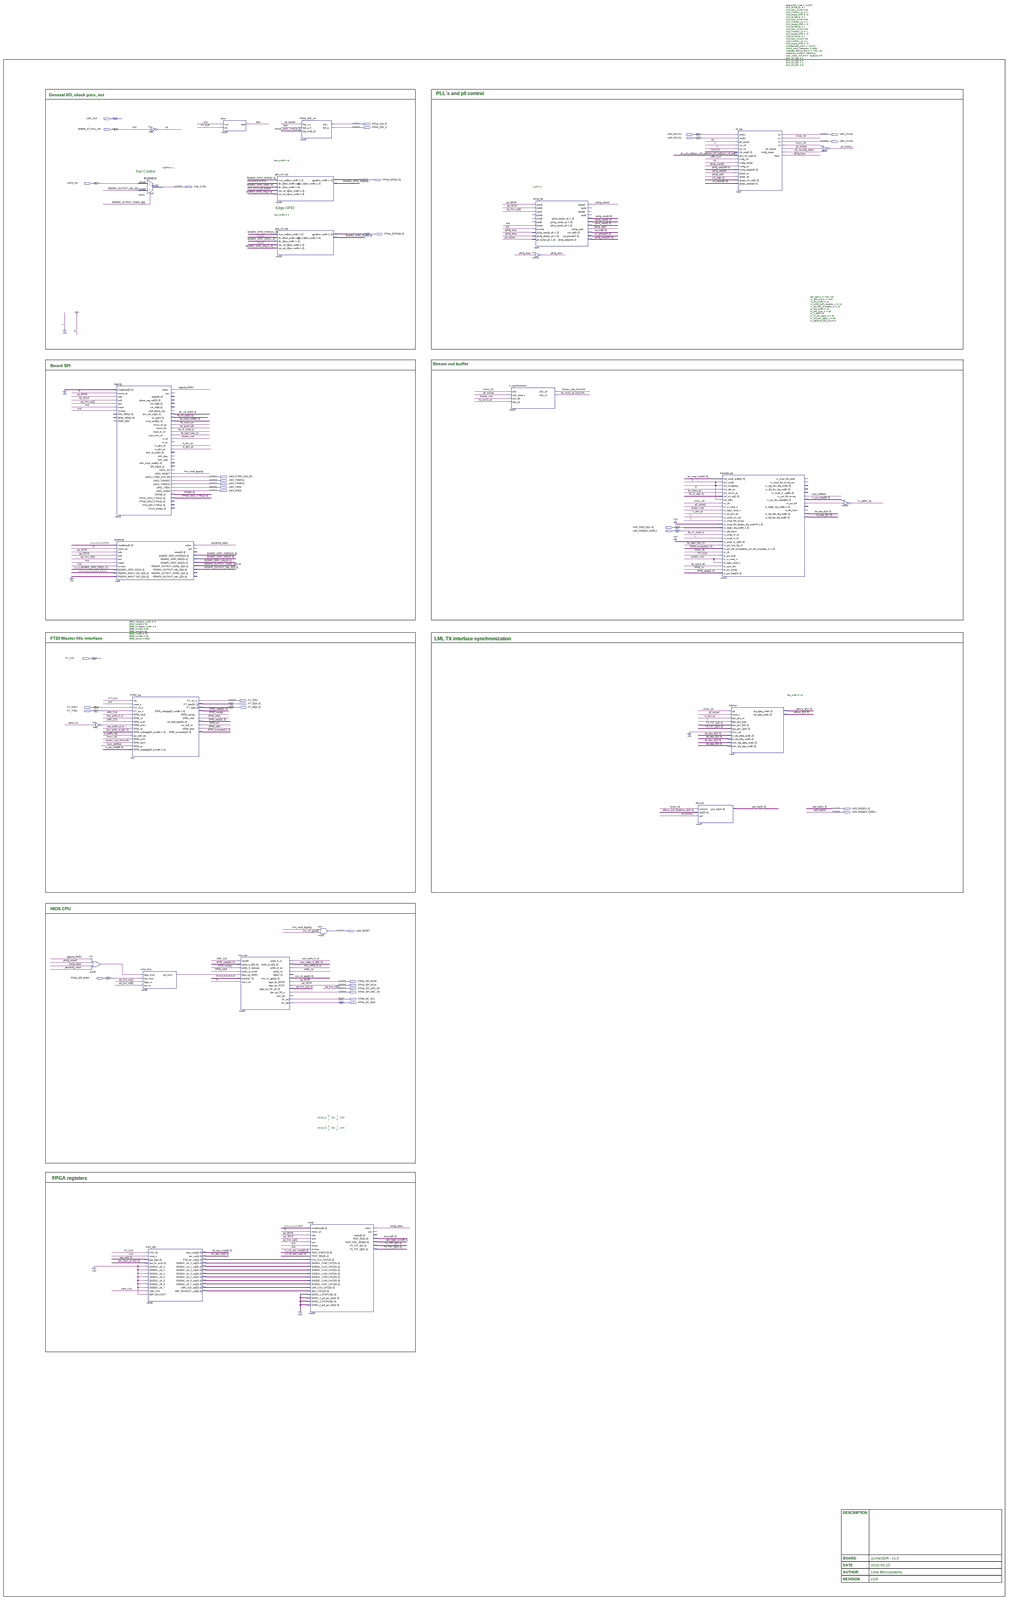
[diagram p0: schematic sheet, whole]
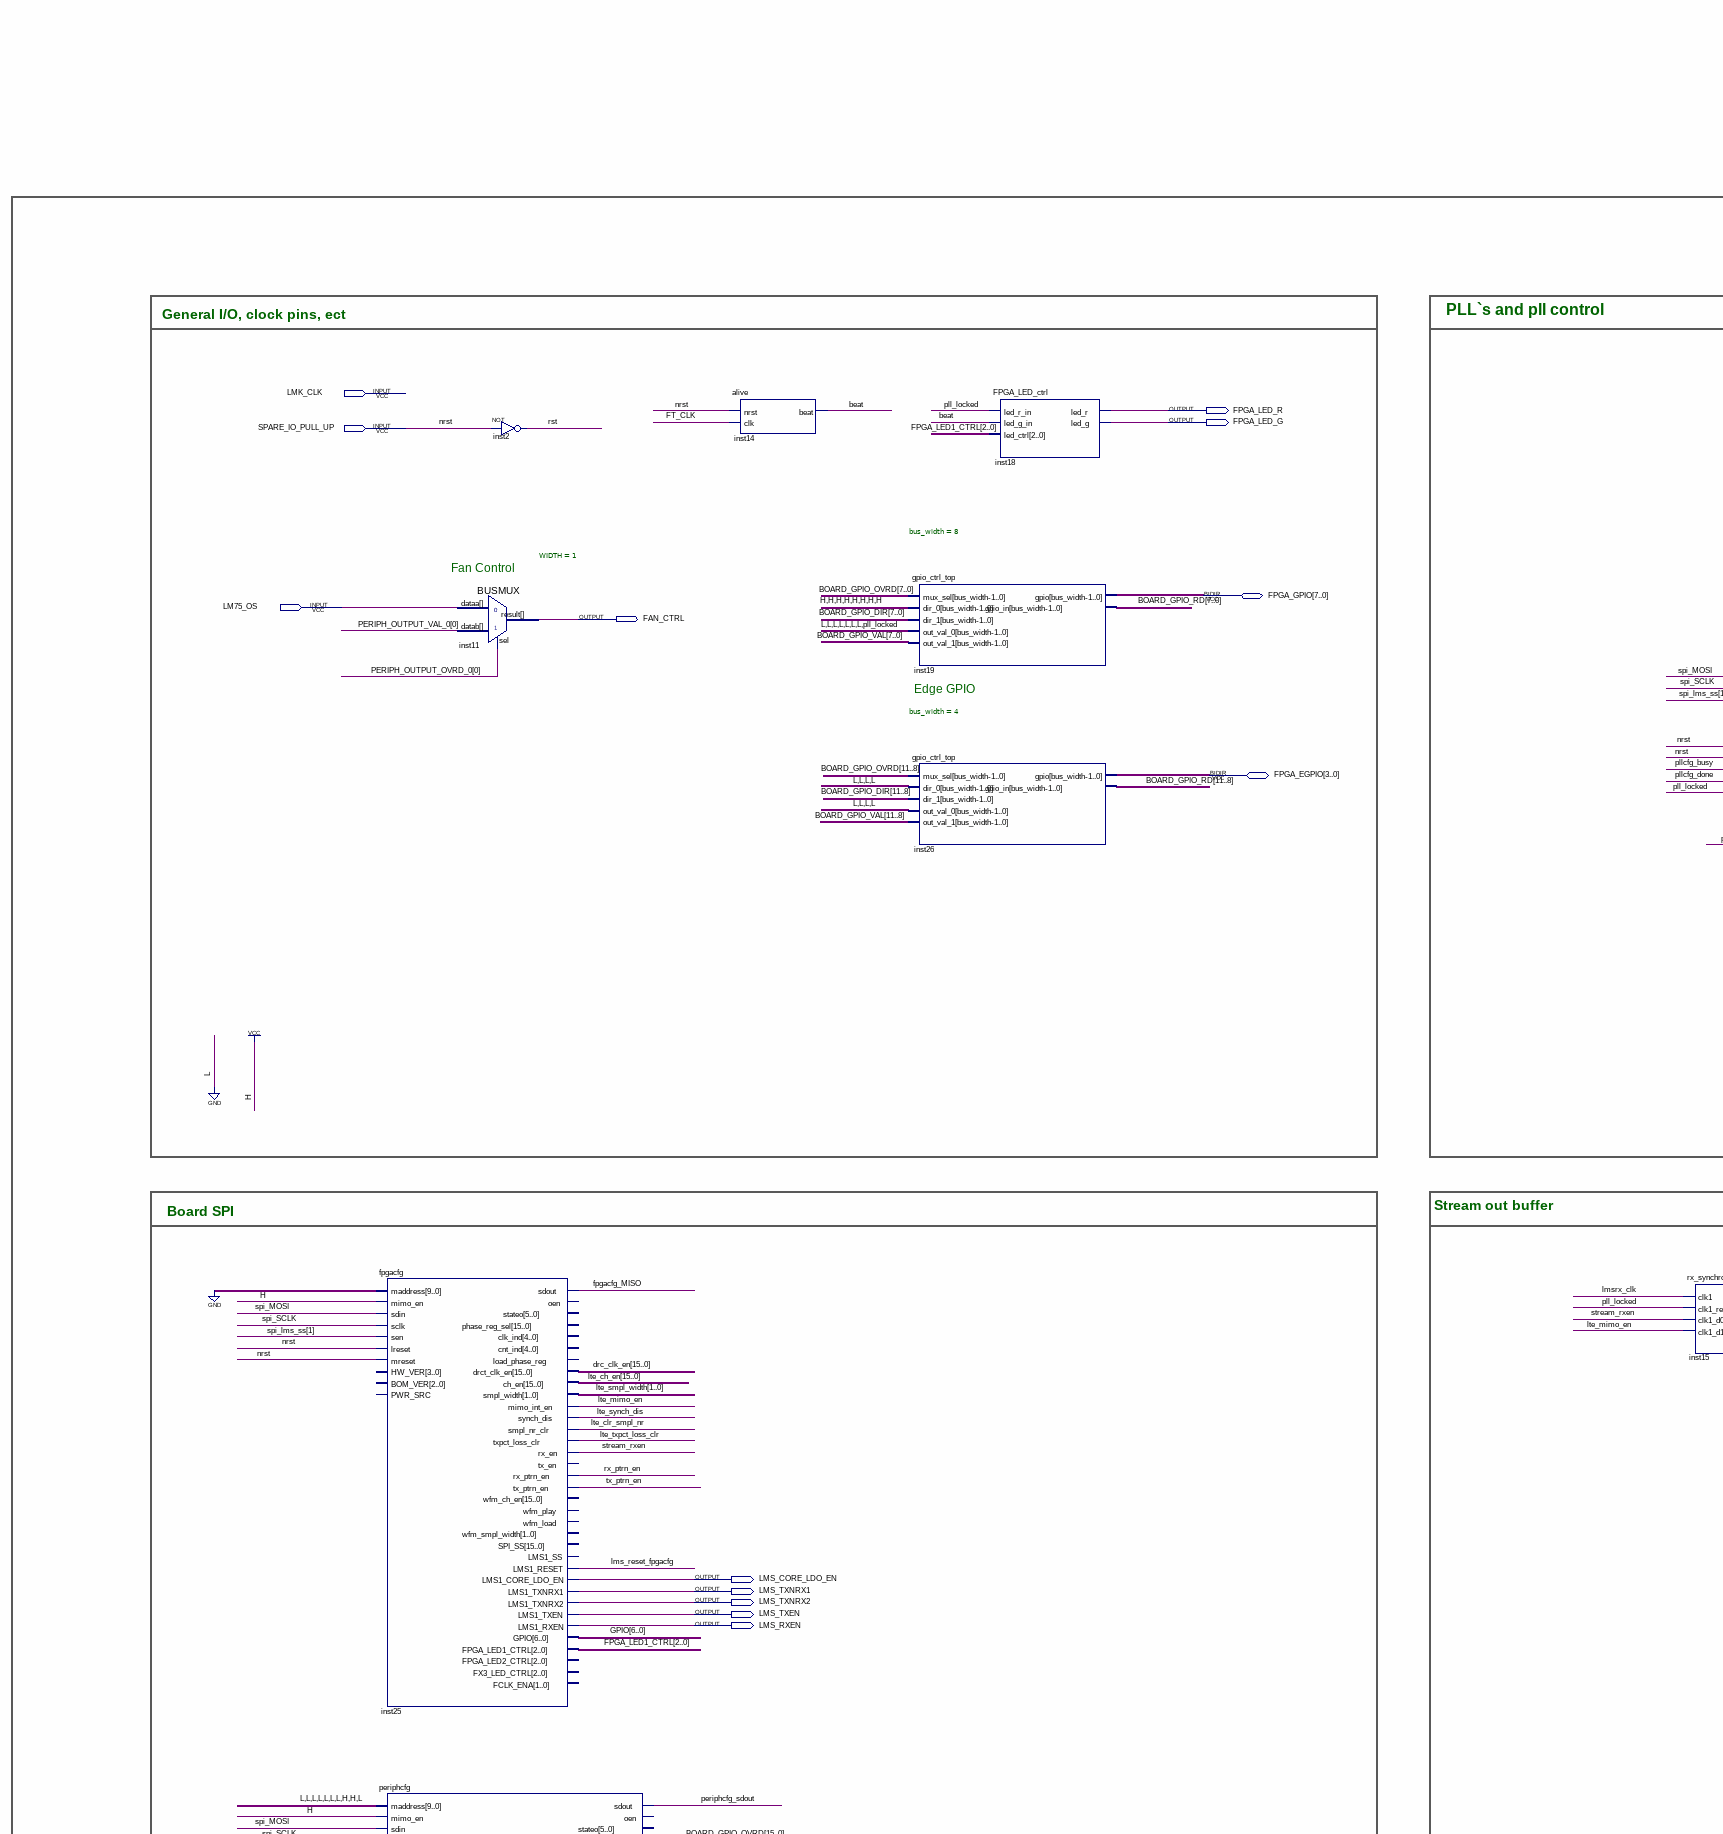
[diagram p1: schematic sheet, upper left part]
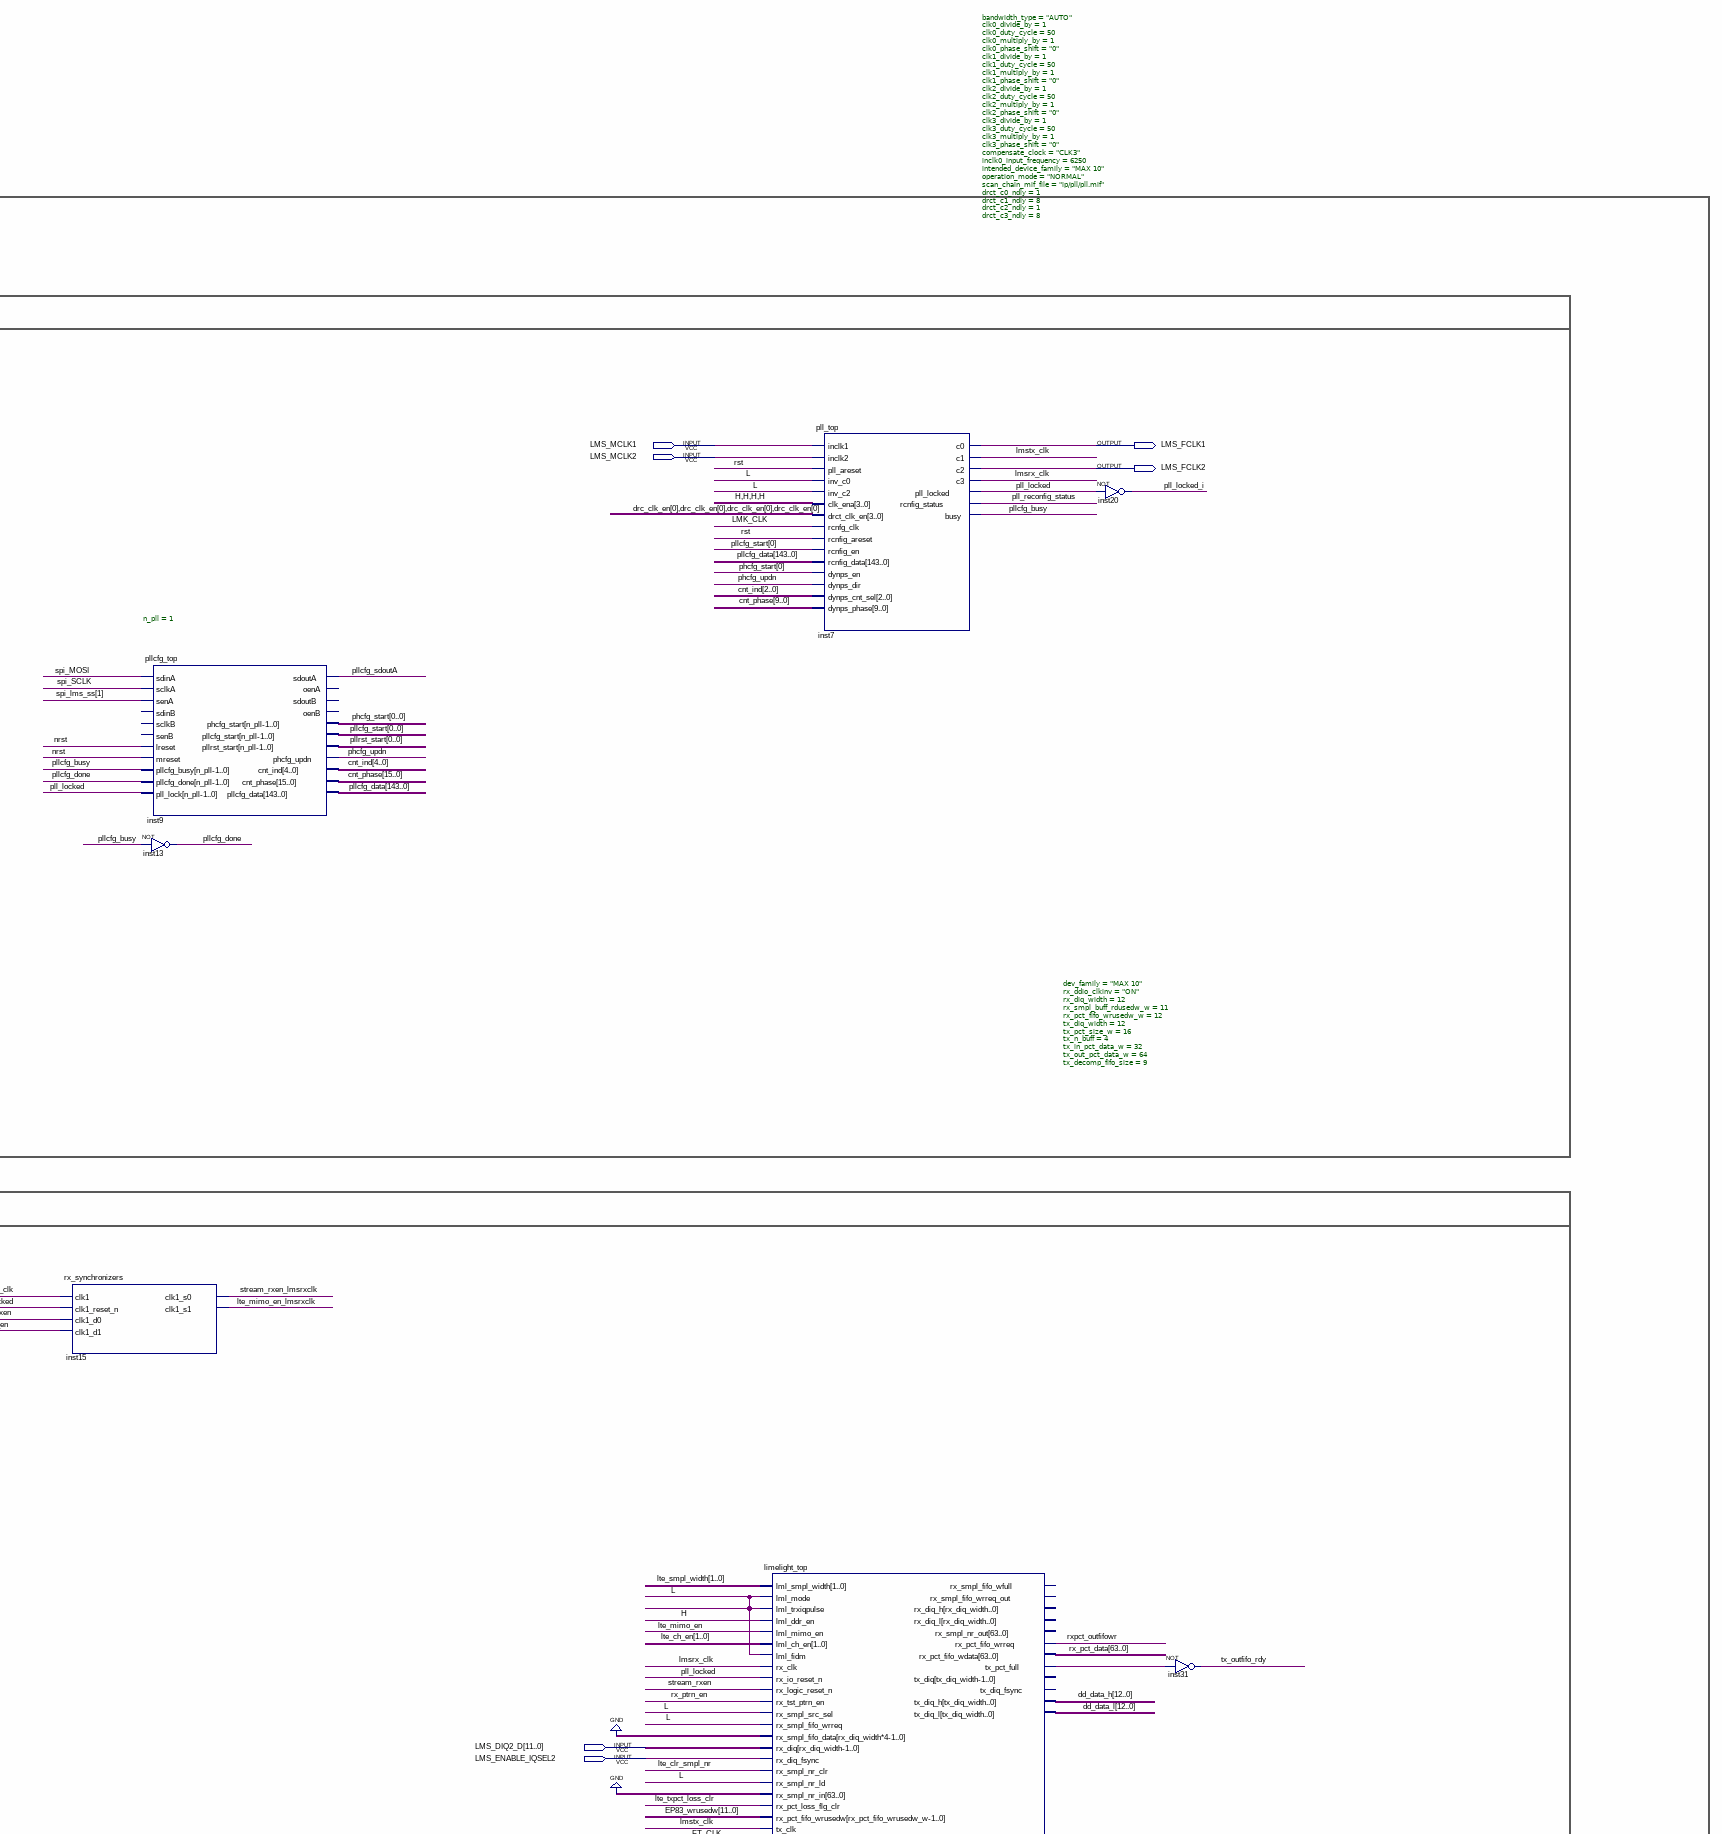
[diagram p2: schematic sheet, upper right part]
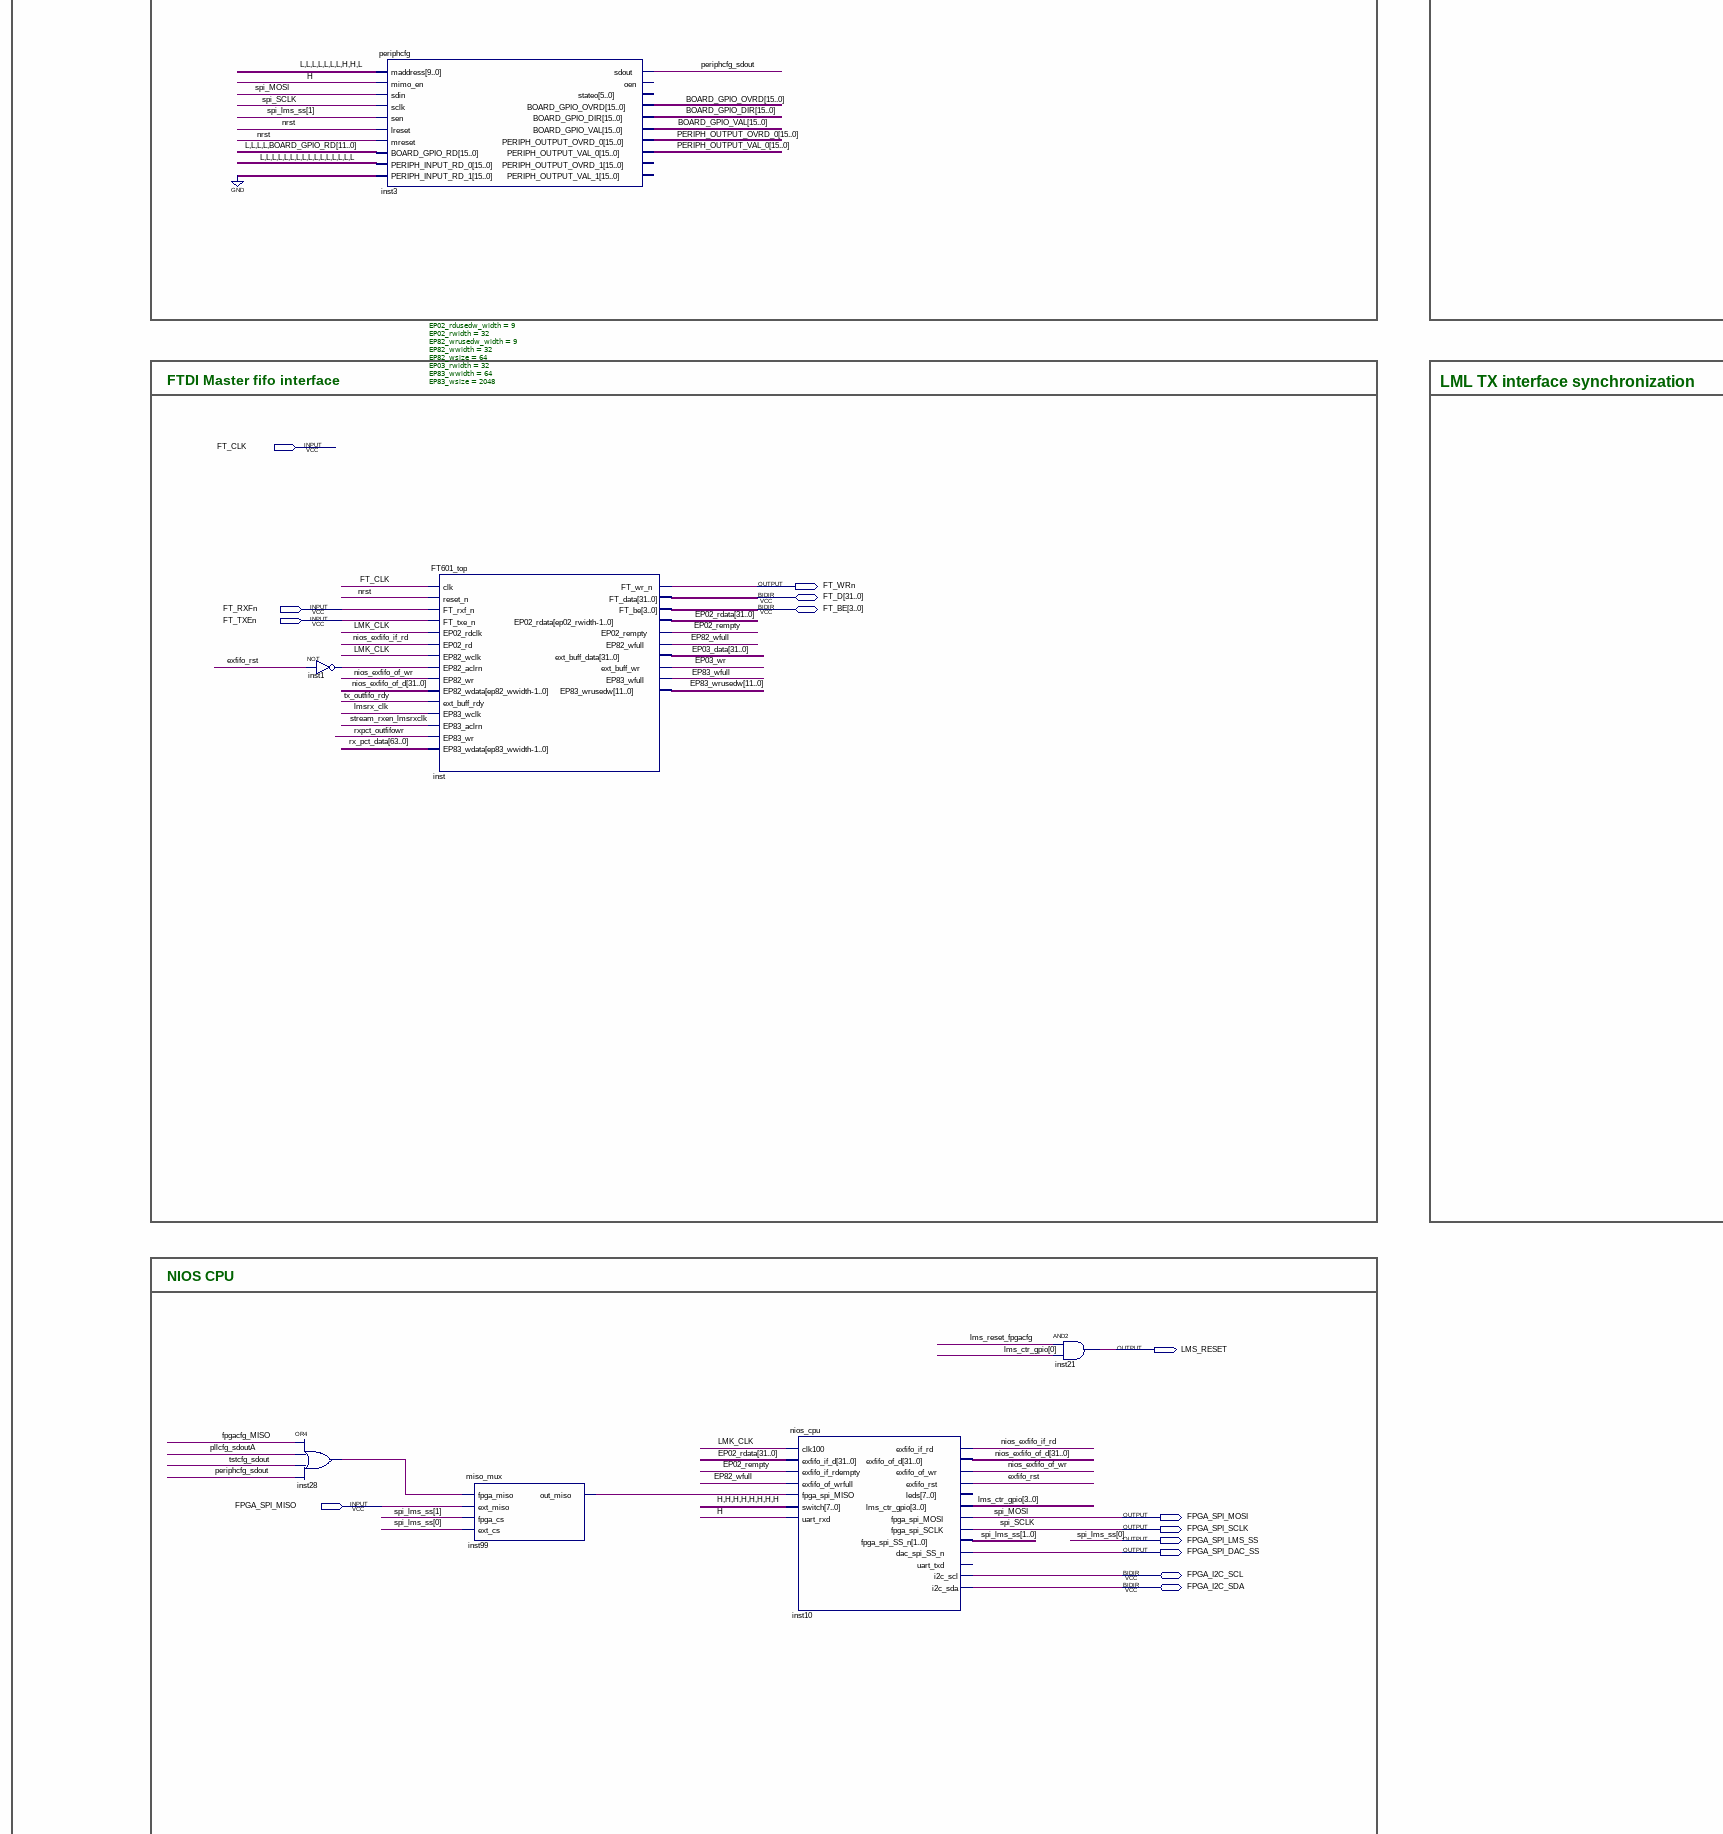
[diagram p3: schematic sheet, middle left part]
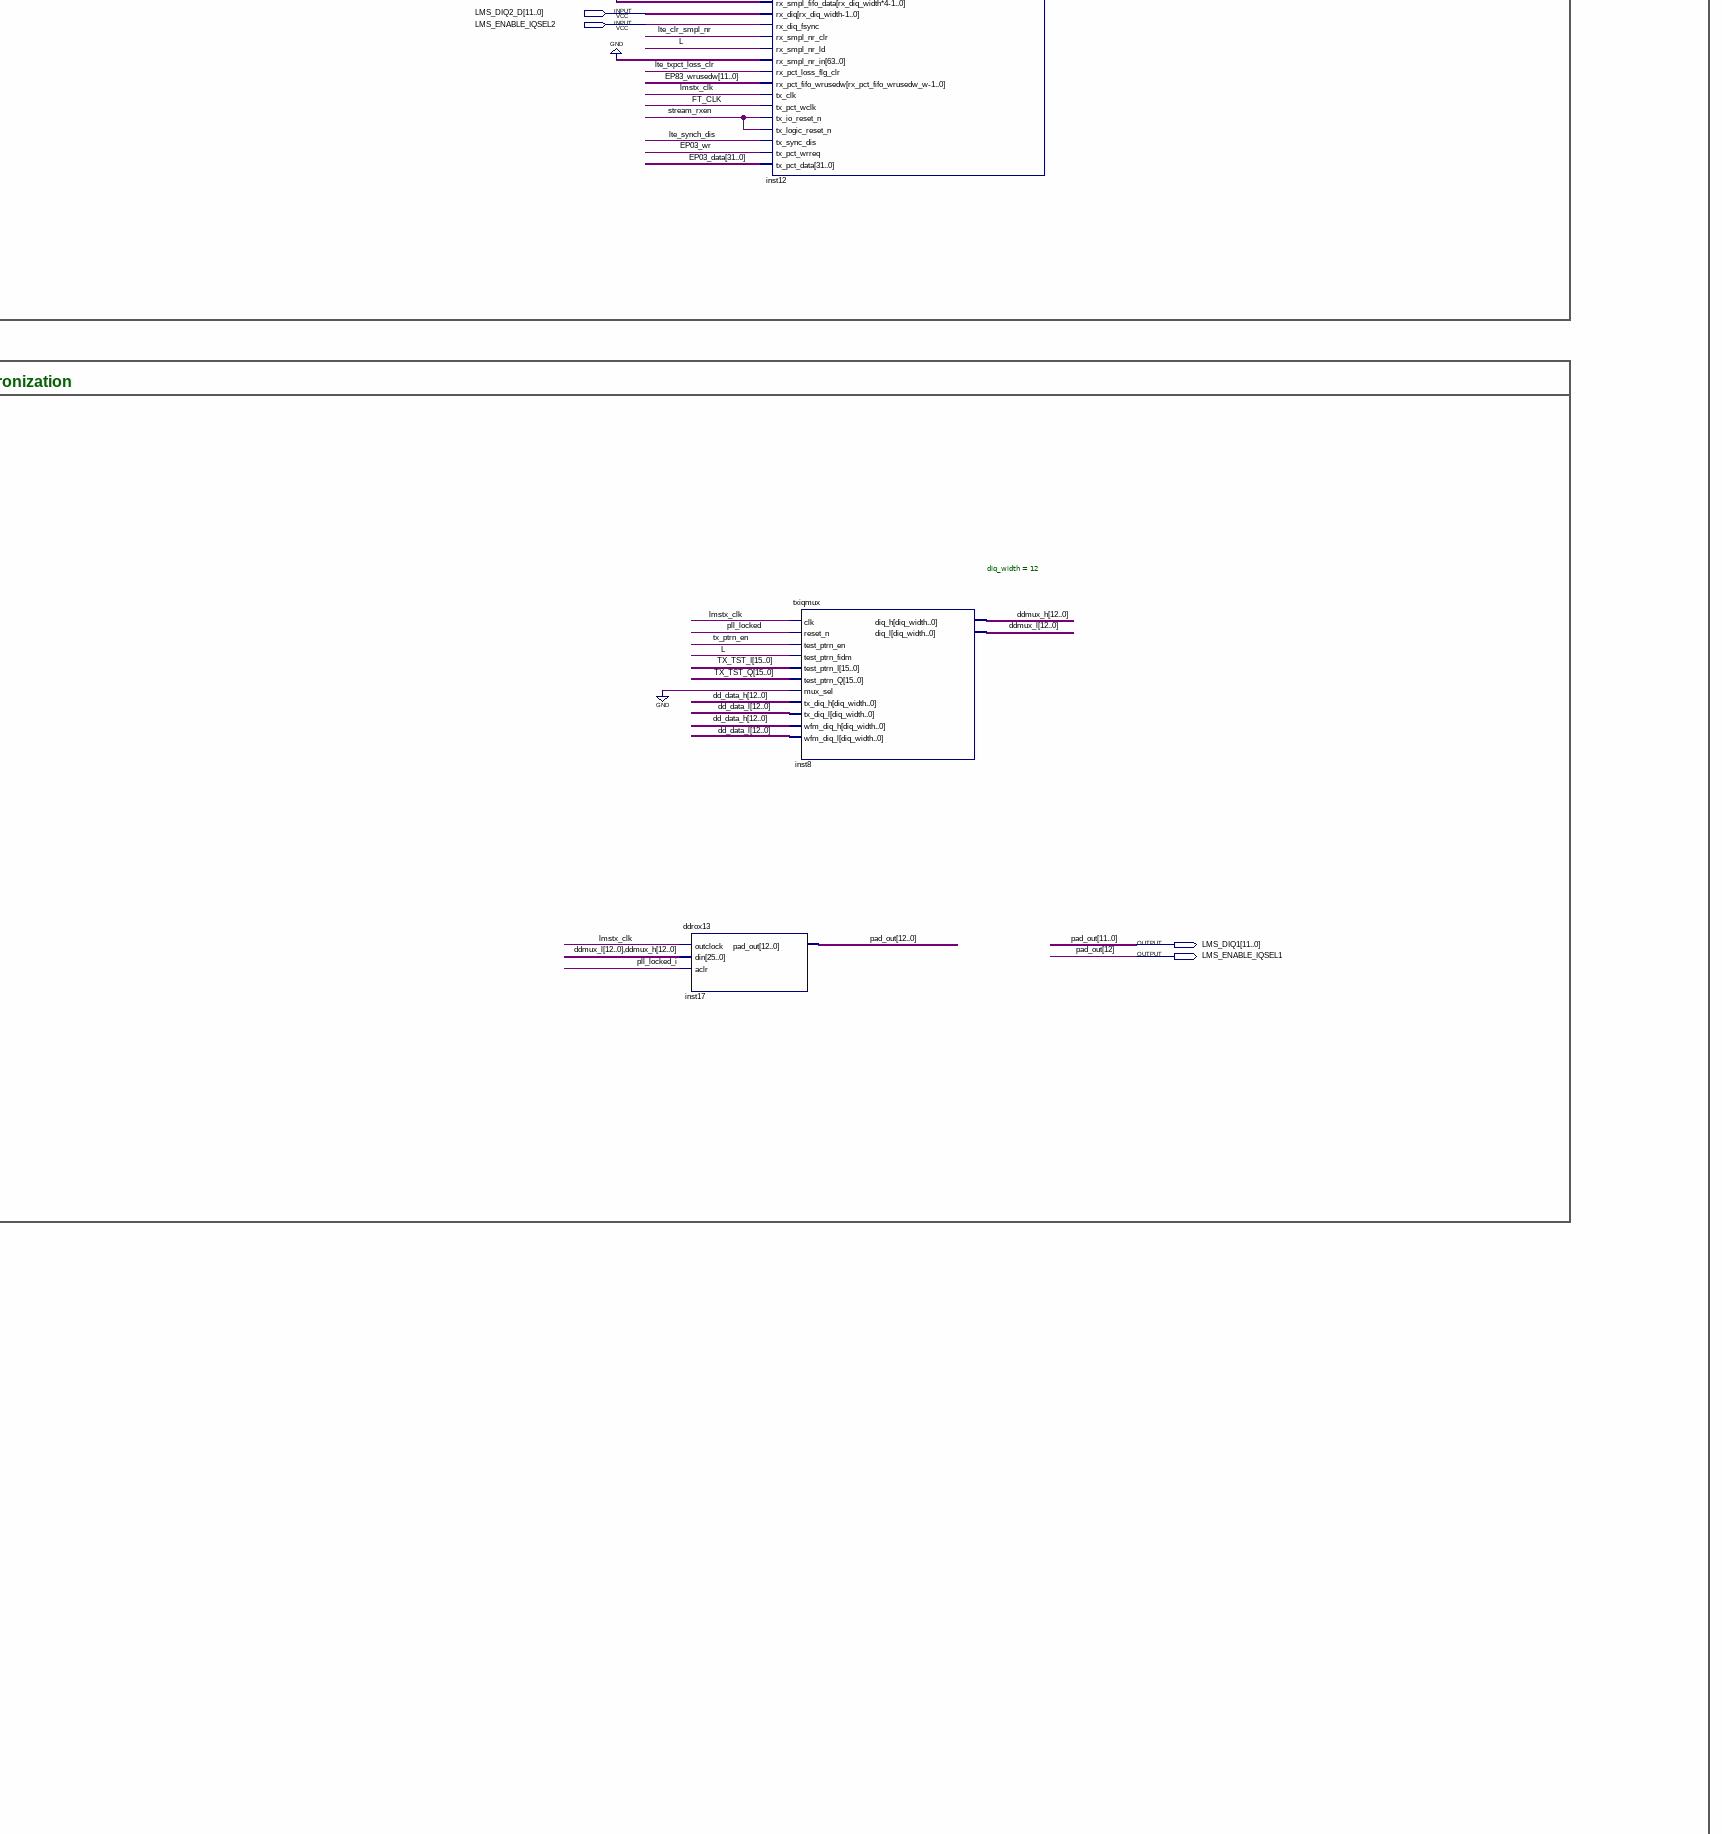
[diagram p4: schematic sheet, middle right part]
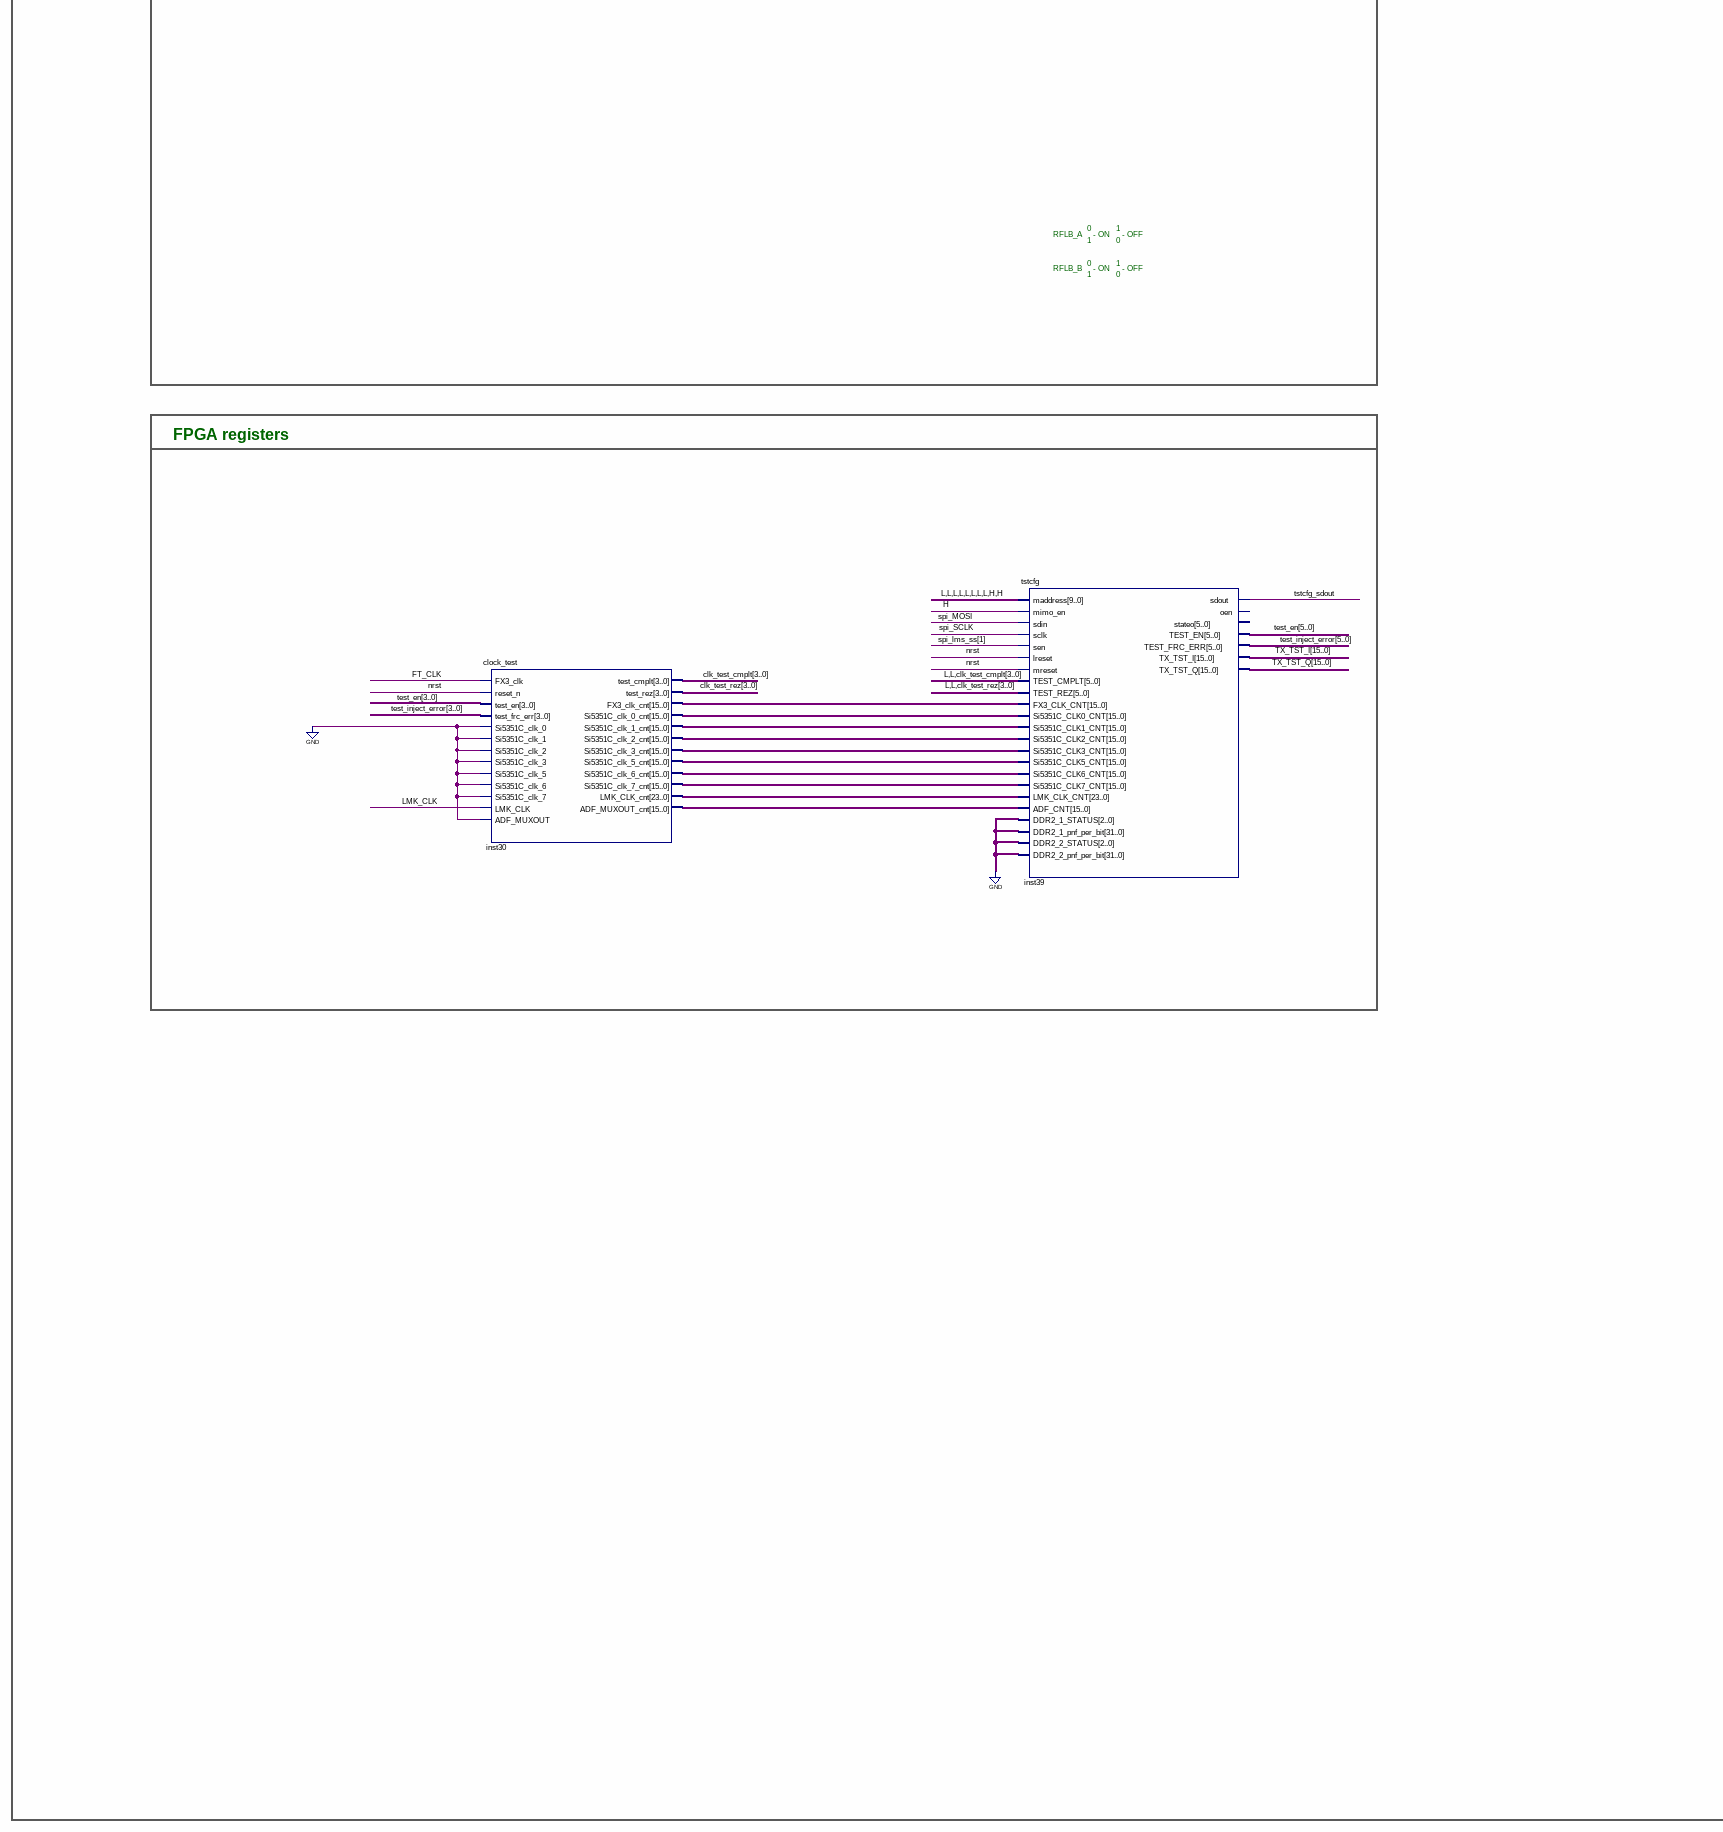
[diagram p5: schematic sheet, lower left part]
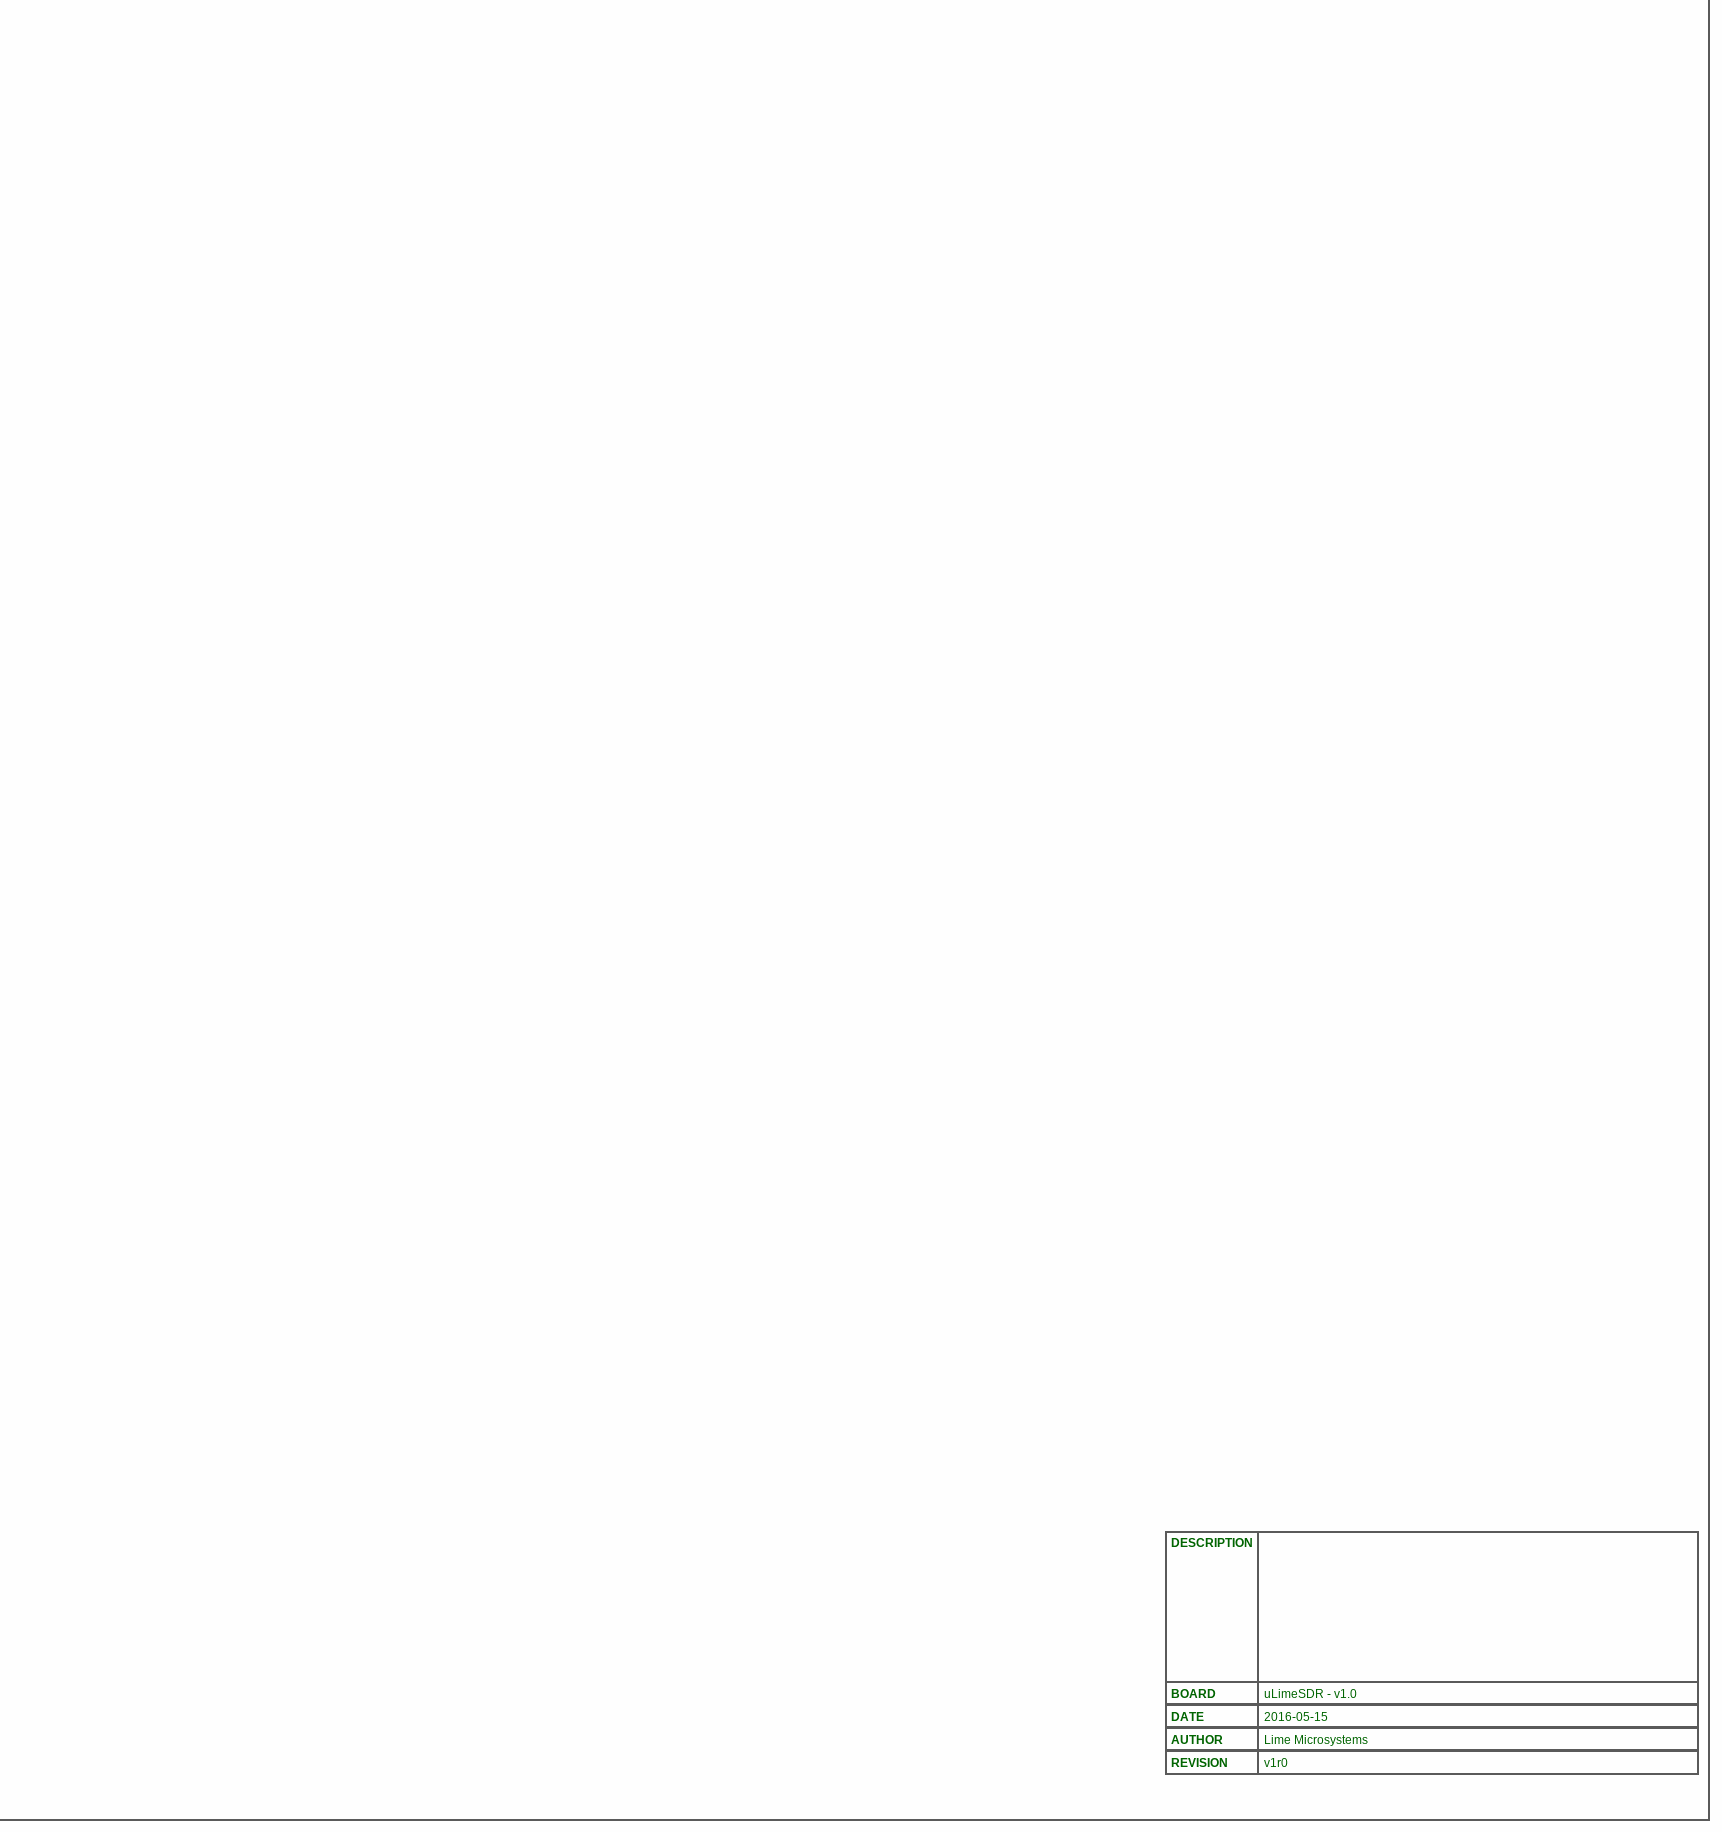
[diagram p6: schematic sheet, lower right part]
// Quartus schematic lms7_trx_top.bdf as structural Verilog: 25 symbols, 35 pins
module lms7_trx_top (
  input  LMK_CLK,
  input  SPARE_IO_PULL_UP,
  input  LMS_MCLK1,
  input  LMS_MCLK2,
  input  LM75_OS,
  input  [11:0] LMS_DIQ2_D,
  input  LMS_ENABLE_IQSEL2,
  input  FT_CLK,
  input  FT_RXFn,
  input  FT_TXEn,
  input  FPGA_SPI_MISO,
  inout  [7:0] FPGA_GPIO,
  inout  [3:0] FPGA_EGPIO,
  inout  [31:0] FT_D,
  inout  [3:0] FT_BE,
  inout  FPGA_I2C_SCL,
  inout  FPGA_I2C_SDA,
  output FPGA_LED_R,
  output FPGA_LED_G,
  output LMS_FCLK1,
  output LMS_FCLK2,
  output FAN_CTRL,
  output LMS_CORE_LDO_EN,
  output LMS_TXNRX1,
  output LMS_TXNRX2,
  output LMS_TXEN,
  output LMS_RXEN,
  output FT_WRn,
  output [11:0] LMS_DIQ1,
  output LMS_ENABLE_IQSEL1,
  output LMS_RESET,
  output FPGA_SPI_MOSI,
  output FPGA_SPI_SCLK,
  output FPGA_SPI_LMS_SS,
  output FPGA_SPI_DAC_SS
);

  wire beat, EP02_rempty, EP03_wr, EP82_wfull, EP83_wfull, exfifo_rst, fpgacfg_MISO, inst1_out,
       inst12_tx_pct_full, inst28_out, inst99_out_miso, lms_reset_fpgacfg, lmsrx_clk, lmstx_clk,
       lte_clr_smpl_nr, lte_mimo_en, lte_mimo_en_lmsrxclk, lte_synch_dis, lte_txpct_loss_clr,
       nios_exfifo_if_rd, nios_exfifo_of_wr, periphcfg_sdout, phcfg_updn, pll_locked, pll_locked_i,
       pll_reconfig_status, pllcfg_busy, pllcfg_done, pllcfg_sdoutA, rst, rx_ptrn_en, rxpct_outfifowr,
       stream_rxen, stream_rxen_lmsrxclk, tstcfg_sdout, tx_outfifo_rdy, tx_ptrn_en;
  wire [0:0] phcfg_start, pllcfg_start, pllrst_start;
  wire [1:0] lte_smpl_width;
  wire [1:1] spi_lms_ss;
  wire [2:0] FPGA_LED1_CTRL;
  wire [3:0] clk_test_cmplt, clk_test_rez, lms_ctr_gpio;
  wire [4:0] cnt_ind;
  wire [5:0] test_en, test_inject_error;
  wire [6:0] GPIO;
  wire [11:0] BOARD_GPIO_RD, EP83_wrusedw;
  wire [12:0] dd_data_h, dd_data_l, ddmux_h, ddmux_l;
  wire [15:0] BOARD_GPIO_DIR, BOARD_GPIO_OVRD, BOARD_GPIO_VAL, cnt_phase, drc_clk_en, inst30_adf_muxout_cnt,
       inst30_fx3_clk_cnt, inst30_si5351c_clk_0_cnt, inst30_si5351c_clk_1_cnt, inst30_si5351c_clk_2_cnt,
       inst30_si5351c_clk_3_cnt, inst30_si5351c_clk_5_cnt, inst30_si5351c_clk_6_cnt,
       inst30_si5351c_clk_7_cnt, lte_ch_en, PERIPH_OUTPUT_OVRD_0, PERIPH_OUTPUT_VAL_0, TX_TST_I, TX_TST_Q;
  wire [23:0] inst30_lmk_clk_cnt;
  wire [31:0] EP02_rdata, EP03_data, nios_exfifo_of_d;
  wire [63:0] rx_pct_data;
  wire [143:0] pllcfg_data;

  not inst1 (inst1_out, exfifo_rst);
  or inst28 (inst28_out, fpgacfg_MISO, pllcfg_sdoutA, tstcfg_sdout, periphcfg_sdout);
  fpgacfg inst25 (
    .maddress({10{1'b0}}), .mimo_en(1'b1), .sdin(FPGA_SPI_MOSI), .sclk(FPGA_SPI_SCLK), .sen(spi_lms_ss[1]),
    .lreset(SPARE_IO_PULL_UP), .mreset(SPARE_IO_PULL_UP), .sdout(fpgacfg_MISO), .drct_clk_en(drc_clk_en),
    .ch_en(lte_ch_en), .smpl_width(lte_smpl_width), .mimo_int_en(lte_mimo_en), .synch_dis(lte_synch_dis),
    .smpl_nr_clr(lte_clr_smpl_nr), .txpct_loss_clr(lte_txpct_loss_clr), .rx_en(stream_rxen),
    .rx_ptrn_en(rx_ptrn_en), .tx_ptrn_en(tx_ptrn_en), .LMS1_RESET(lms_reset_fpgacfg),
    .LMS1_CORE_LDO_EN(LMS_CORE_LDO_EN), .LMS1_TXNRX1(LMS_TXNRX1), .LMS1_TXNRX2(LMS_TXNRX2),
    .LMS1_TXEN(LMS_TXEN), .LMS1_RXEN(LMS_RXEN), .GPIO(GPIO), .FPGA_LED1_CTRL(FPGA_LED1_CTRL));  // open: HW_VER, BOM_VER, PWR_SRC, oen, stateo, phase_reg_sel, clk_ind, cnt_ind, load_phase_reg, tx_en, wfm_ch_en, wfm_play, wfm_load, wfm_smpl_width, SPI_SS, LMS1_SS, FPGA_LED2_CTRL, FX3_LED_CTRL, FCLK_ENA
  periphcfg inst3 (
    .maddress(10'b0000000110), .mimo_en(1'b1), .sdin(FPGA_SPI_MOSI), .sclk(FPGA_SPI_SCLK),
    .sen(spi_lms_ss[1]), .lreset(SPARE_IO_PULL_UP), .mreset(SPARE_IO_PULL_UP),
    .BOARD_GPIO_RD({4'b0000, BOARD_GPIO_RD}), .PERIPH_INPUT_RD_0({16{1'b0}}), .PERIPH_INPUT_RD_1({16{1'b0}}),
    .sdout(periphcfg_sdout), .BOARD_GPIO_OVRD(BOARD_GPIO_OVRD), .BOARD_GPIO_DIR(BOARD_GPIO_DIR),
    .BOARD_GPIO_VAL(BOARD_GPIO_VAL), .PERIPH_OUTPUT_OVRD_0(PERIPH_OUTPUT_OVRD_0),
    .PERIPH_OUTPUT_VAL_0(PERIPH_OUTPUT_VAL_0));  // open: oen, stateo, PERIPH_OUTPUT_OVRD_1, PERIPH_OUTPUT_VAL_1
  FT601_top #(.EP02_rdusedw_width(9), .EP02_rwidth(32), .EP82_wrusedw_width(9), .EP82_wwidth(32), .EP82_wsize(64), .EP03_rwidth(32), .EP83_wwidth(64), .EP83_wsize(2048)) inst (
    .clk(FT_CLK), .reset_n(SPARE_IO_PULL_UP), .FT_rxf_n(FT_RXFn), .FT_txe_n(FT_TXEn), .EP02_rdclk(LMK_CLK),
    .EP02_rd(nios_exfifo_if_rd), .EP82_wclk(LMK_CLK), .EP82_aclrn(inst1_out), .EP82_wr(nios_exfifo_of_wr),
    .EP82_wdata(nios_exfifo_of_d), .ext_buff_rdy(tx_outfifo_rdy), .EP83_wclk(lmsrx_clk),
    .EP83_aclrn(stream_rxen_lmsrxclk), .EP83_wr(rxpct_outfifowr), .EP83_wdata(rx_pct_data), .FT_wr_n(FT_WRn),
    .EP02_rdata(EP02_rdata), .EP02_rempty(EP02_rempty), .EP82_wfull(EP82_wfull), .ext_buff_data(EP03_data),
    .ext_buff_wr(EP03_wr), .EP83_wfull(EP83_wfull), .EP83_wrusedw(EP83_wrusedw), .FT_data(FT_D), .FT_be(FT_BE));
  not inst2 (rst, SPARE_IO_PULL_UP);
  BUSMUX #(.WIDTH(1)) inst11 (
    .datab(PERIPH_OUTPUT_VAL_0[0]), .sel(PERIPH_OUTPUT_OVRD_0[0]), .dataa(LM75_OS), .result(FAN_CTRL));
  miso_mux inst99 (
    .fpga_miso(inst28_out), .ext_miso(FPGA_SPI_MISO), .fpga_cs(spi_lms_ss[1]), .ext_cs(FPGA_SPI_LMS_SS),
    .out_miso(inst99_out_miso));
  clock_test inst30 (
    .FX3_clk(FT_CLK), .reset_n(SPARE_IO_PULL_UP), .test_en(test_en[3:0]),
    .test_frc_err(test_inject_error[3:0]), .Si5351C_clk_0(1'b0), .Si5351C_clk_1(1'b0), .Si5351C_clk_2(1'b0),
    .Si5351C_clk_3(1'b0), .Si5351C_clk_5(1'b0), .Si5351C_clk_6(1'b0), .Si5351C_clk_7(1'b0),
    .LMK_CLK(LMK_CLK), .ADF_MUXOUT(1'b0), .test_cmplt(clk_test_cmplt), .test_rez(clk_test_rez),
    .FX3_clk_cnt(inst30_fx3_clk_cnt), .Si5351C_clk_0_cnt(inst30_si5351c_clk_0_cnt),
    .Si5351C_clk_1_cnt(inst30_si5351c_clk_1_cnt), .Si5351C_clk_2_cnt(inst30_si5351c_clk_2_cnt),
    .Si5351C_clk_3_cnt(inst30_si5351c_clk_3_cnt), .Si5351C_clk_5_cnt(inst30_si5351c_clk_5_cnt),
    .Si5351C_clk_6_cnt(inst30_si5351c_clk_6_cnt), .Si5351C_clk_7_cnt(inst30_si5351c_clk_7_cnt),
    .LMK_CLK_cnt(inst30_lmk_clk_cnt), .ADF_MUXOUT_cnt(inst30_adf_muxout_cnt));
  alive inst14 (.nrst(SPARE_IO_PULL_UP), .clk(FT_CLK), .beat(beat));
  nios_cpu inst10 (
    .clk100(LMK_CLK), .exfifo_if_d(EP02_rdata), .exfifo_if_rdempty(EP02_rempty),
    .exfifo_of_wrfull(EP82_wfull), .fpga_spi_MISO(inst99_out_miso), .switch({8{1'b1}}), .uart_rxd(1'b1),
    .exfifo_if_rd(nios_exfifo_if_rd), .exfifo_of_d(nios_exfifo_of_d), .exfifo_of_wr(nios_exfifo_of_wr),
    .exfifo_rst(exfifo_rst), .lms_ctr_gpio(lms_ctr_gpio), .fpga_spi_MOSI(FPGA_SPI_MOSI),
    .fpga_spi_SCLK(FPGA_SPI_SCLK), .fpga_spi_SS_n({spi_lms_ss[1], FPGA_SPI_LMS_SS}),
    .dac_spi_SS_n(FPGA_SPI_DAC_SS), .i2c_scl(FPGA_I2C_SCL), .i2c_sda(FPGA_I2C_SDA));  // open: leds, uart_txd
  gpio_ctrl_top #(.bus_width(8)) inst19 (
    .mux_sel(BOARD_GPIO_OVRD[7:0]), .dir_0({8{1'b1}}), .dir_1(BOARD_GPIO_DIR[7:0]),
    .out_val_0({{7{1'b0}}, pll_locked}), .out_val_1(BOARD_GPIO_VAL[7:0]), .gpio_in(BOARD_GPIO_RD[7:0]),
    .gpio(FPGA_GPIO));
  gpio_ctrl_top #(.bus_width(4)) inst26 (
    .mux_sel(BOARD_GPIO_OVRD[11:8]), .dir_0(4'b0000), .dir_1(BOARD_GPIO_DIR[11:8]), .out_val_0(4'b0000),
    .out_val_1(BOARD_GPIO_VAL[11:8]), .gpio_in(BOARD_GPIO_RD[11:8]), .gpio(FPGA_EGPIO));
  FPGA_LED_ctrl inst18 (
    .led_r_in(pll_locked), .led_g_in(beat), .led_ctrl(FPGA_LED1_CTRL), .led_r(FPGA_LED_R), .led_g(FPGA_LED_G));
  and inst21 (LMS_RESET, lms_reset_fpgacfg, lms_ctr_gpio[0]);
  tstcfg inst39 (
    .maddress(10'b0000000011), .mimo_en(1'b1), .sdin(FPGA_SPI_MOSI), .sclk(FPGA_SPI_SCLK),
    .sen(spi_lms_ss[1]), .lreset(SPARE_IO_PULL_UP), .mreset(SPARE_IO_PULL_UP),
    .TEST_CMPLT({2'b00, clk_test_cmplt}), .TEST_REZ({2'b00, clk_test_rez}), .FX3_CLK_CNT(inst30_fx3_clk_cnt),
    .Si5351C_CLK0_CNT(inst30_si5351c_clk_0_cnt), .Si5351C_CLK1_CNT(inst30_si5351c_clk_1_cnt),
    .Si5351C_CLK2_CNT(inst30_si5351c_clk_2_cnt), .Si5351C_CLK3_CNT(inst30_si5351c_clk_3_cnt),
    .Si5351C_CLK5_CNT(inst30_si5351c_clk_5_cnt), .Si5351C_CLK6_CNT(inst30_si5351c_clk_6_cnt),
    .Si5351C_CLK7_CNT(inst30_si5351c_clk_7_cnt), .LMK_CLK_CNT(inst30_lmk_clk_cnt),
    .ADF_CNT(inst30_adf_muxout_cnt), .DDR2_1_STATUS({32{1'b0}}), .DDR2_1_pnf_per_bit({32{1'b0}}),
    .DDR2_2_STATUS({32{1'b0}}), .DDR2_2_pnf_per_bit({32{1'b0}}), .sdout(tstcfg_sdout), .TEST_EN(test_en),
    .TEST_FRC_ERR(test_inject_error), .TX_TST_I(TX_TST_I), .TX_TST_Q(TX_TST_Q));  // open: oen, stateo
  rx_synchronizers inst15 (
    .clk1(lmsrx_clk), .clk1_reset_n(pll_locked), .clk1_d0(stream_rxen), .clk1_d1(lte_mimo_en),
    .clk1_s0(stream_rxen_lmsrxclk), .clk1_s1(lte_mimo_en_lmsrxclk));
  pllcfg_top #(.n_pll(1)) inst9 (
    .sdinA(FPGA_SPI_MOSI), .sclkA(FPGA_SPI_SCLK), .senA(spi_lms_ss[1]), .lreset(SPARE_IO_PULL_UP),
    .mreset(SPARE_IO_PULL_UP), .pllcfg_busy(pllcfg_busy), .pllcfg_done(pllcfg_done), .pll_lock(pll_locked),
    .sdoutA(pllcfg_sdoutA), .phcfg_start(phcfg_start[0]), .pllcfg_start(pllcfg_start[0]),
    .pllrst_start(pllrst_start[0]), .phcfg_updn(phcfg_updn), .cnt_ind(cnt_ind), .cnt_phase(cnt_phase),
    .pllcfg_data(pllcfg_data));  // open: sdinB, sclkB, senB, oenA, sdoutB, oenB
  not inst13 (pllcfg_done, pllcfg_busy);
  ddrox13 inst17 (
    .outclock(lmstx_clk), .din({ddmux_l, ddmux_h}), .aclr(pll_locked_i),
    .pad_out({LMS_ENABLE_IQSEL1, LMS_DIQ1}));
  limelight_top #(.dev_family("MAX 10"), .rx_ddio_clkinv("ON"), .rx_diq_width(12), .rx_smpl_buff_rdusedw_w(11), .rx_pct_fifo_wrusedw_w(12), .tx_diq_width(12), .tx_pct_size_w(16), .tx_n_buff(4), .tx_in_pct_data_w(32), .tx_out_pct_data_w(64), .tx_decomp_fifo_size(9)) inst12 (
    .lml_smpl_width(lte_smpl_width), .lml_mode(1'b0), .lml_trxiqpulse(1'b0), .lml_ddr_en(1'b1),
    .lml_mimo_en(lte_mimo_en), .lml_ch_en(lte_ch_en[1:0]), .lml_fidm(1'b0), .rx_clk(lmsrx_clk),
    .rx_io_reset_n(pll_locked), .rx_logic_reset_n(stream_rxen), .rx_tst_ptrn_en(rx_ptrn_en),
    .rx_smpl_src_sel(1'b0), .rx_smpl_fifo_wrreq(1'b0), .rx_smpl_fifo_data({48{1'b0}}), .rx_diq(LMS_DIQ2_D),
    .rx_diq_fsync(LMS_ENABLE_IQSEL2), .rx_smpl_nr_clr(lte_clr_smpl_nr), .rx_smpl_nr_ld(1'b0),
    .rx_smpl_nr_in({64{1'b0}}), .rx_pct_loss_flg_clr(lte_txpct_loss_clr), .rx_pct_fifo_wrusedw(EP83_wrusedw),
    .tx_clk(lmstx_clk), .tx_pct_wclk(FT_CLK), .tx_io_reset_n(stream_rxen), .tx_logic_reset_n(stream_rxen),
    .tx_sync_dis(lte_synch_dis), .tx_pct_wrreq(EP03_wr), .tx_pct_data(EP03_data),
    .rx_pct_fifo_wrreq(rxpct_outfifowr), .rx_pct_fifo_wdata(rx_pct_data), .tx_pct_full(inst12_tx_pct_full),
    .tx_diq_h(dd_data_h), .tx_diq_l(dd_data_l));  // open: rx_smpl_fifo_wfull, rx_smpl_fifo_wrreq_out, rx_diq_h, rx_diq_l, rx_smpl_nr_out, tx_diq, tx_diq_fsync
  pll_top #(.bandwidth_type("AUTO"), .clk0_divide_by(1), .clk0_duty_cycle(50), .clk0_multiply_by(1), .clk0_phase_shift("0"), .clk1_divide_by(1), .clk1_duty_cycle(50), .clk1_multiply_by(1), .clk1_phase_shift("0"), .clk2_divide_by(1), .clk2_duty_cycle(50), .clk2_multiply_by(1), .clk2_phase_shift("0"), .clk3_divide_by(1), .clk3_duty_cycle(50), .clk3_multiply_by(1), .clk3_phase_shift("0"), .compensate_clock("CLK3"), .inclk0_input_frequency(6250), .intended_device_family("MAX 10"), .operation_mode("NORMAL"), .scan_chain_mif_file("ip/pll/pll.mif"), .drct_c0_ndly(1), .drct_c1_ndly(8), .drct_c2_ndly(1), .drct_c3_ndly(8)) inst7 (
    .inclk1(LMS_MCLK1), .inclk2(LMS_MCLK2), .pll_areset(rst), .inv_c0(1'b0), .inv_c2(1'b0),
    .clk_ena(4'b1111), .drct_clk_en({4{drc_clk_en[0]}}), .rcnfg_clk(LMK_CLK), .rcnfig_areset(rst),
    .rcnfig_en(pllcfg_start[0]), .rcnfig_data(pllcfg_data), .dynps_en(phcfg_start[0]),
    .dynps_dir(phcfg_updn), .dynps_cnt_sel(cnt_ind[2:0]), .dynps_phase(cnt_phase[9:0]), .c0(LMS_FCLK1),
    .c1(lmstx_clk), .c2(LMS_FCLK2), .c3(lmsrx_clk), .pll_locked(pll_locked),
    .rcnfig_status(pll_reconfig_status), .busy(pllcfg_busy));
  txiqmux #(.diq_width(12)) inst8 (
    .clk(lmstx_clk), .reset_n(pll_locked), .test_ptrn_en(tx_ptrn_en), .test_ptrn_fidm(1'b0),
    .test_ptrn_I(TX_TST_I), .test_ptrn_Q(TX_TST_Q), .mux_sel(1'b0), .tx_diq_h(dd_data_h),
    .tx_diq_l(dd_data_l), .wfm_diq_h(dd_data_h), .wfm_diq_l(dd_data_l), .diq_h(ddmux_h), .diq_l(ddmux_l));
  not inst20 (pll_locked_i, pll_locked);
  not inst31 (tx_outfifo_rdy, inst12_tx_pct_full);

  // Other names for the same wires on the sheet: nrst = SPARE_IO_PULL_UP;
  //   pad_out[12:0] = {LMS_ENABLE_IQSEL1, LMS_DIQ1}; spi_lms_ss[0] = FPGA_SPI_LMS_SS; spi_MOSI = FPGA_SPI_MOSI;
  //   spi_SCLK = FPGA_SPI_SCLK

  // Notes on the sheet:
  //   PLL`s and pll control
  //   General I/O, clock pins, ect
  //   Fan Control
  //   Edge GPIO
  //   Stream out buffer
  //   Board SPI
  //   FTDI Master fifo interface
  //   LML TX interface synchronization
  //   NIOS CPU
  //   0
  //   1
  //   RFLB_A
  //   - ON
  //   - OFF
  //   1
  //   0
  //   0
  //   1
  //   RFLB_B
  //   - ON
  //   - OFF
  //   1
  //   0
  //   FPGA registers
  //   DESCRIPTION
  //   BOARD
  //   uLimeSDR - v1.0
  //   DATE
  //   2016-05-15
  //   AUTHOR
  //   Lime Microsystems
  //   REVISION
  //   v1r0
endmodule
